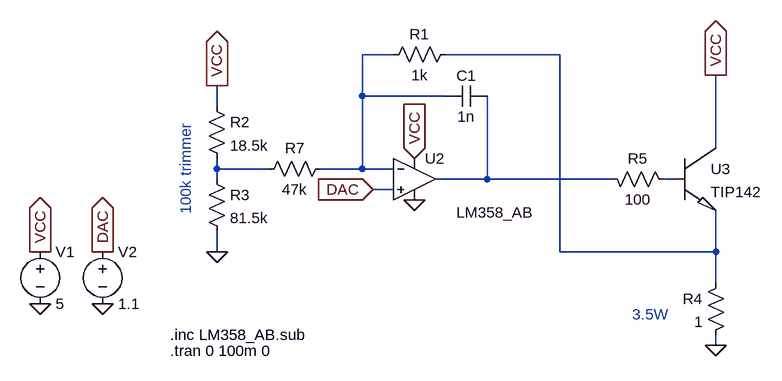
[diagram p0: schematic discharge.asc]
discharge.asc, the LTspice schematic file:
Version 4
SHEET 1 2016 680
WIRE 1168 -80 1120 -80
WIRE 1424 -80 1248 -80
WIRE 1120 -16 1120 -80
WIRE 1248 -16 1120 -16
WIRE 896 0 896 -32
WIRE 1664 64 1664 -48
WIRE 896 96 896 80
WIRE 976 96 896 96
WIRE 1120 96 1120 -16
WIRE 1120 96 1056 96
WIRE 1168 96 1120 96
WIRE 896 112 896 96
WIRE 1312 112 1312 -16
WIRE 1312 112 1232 112
WIRE 1504 112 1312 112
WIRE 1600 112 1584 112
WIRE 1168 128 1136 128
WIRE 896 224 896 192
WIRE 1424 224 1424 -80
WIRE 1664 224 1664 160
WIRE 1664 224 1424 224
WIRE 1664 272 1664 224
WIRE 1664 368 1664 352
FLAG 1136 128 DAC
IOPIN 1136 128 In
FLAG 720 304 0
FLAG 720 224 DAC
IOPIN 720 224 Out
FLAG 624 304 0
FLAG 624 224 VCC
IOPIN 624 224 Out
FLAG 1200 80 VCC
IOPIN 1200 80 In
FLAG 896 -32 VCC
IOPIN 896 -32 Out
FLAG 1664 368 0
FLAG 1664 -48 VCC
IOPIN 1664 -48 Out
FLAG 1200 144 0
FLAG 896 224 0
SYMBOL voltage 624 208 R0
WINDOW 123 0 0 Left 0
WINDOW 39 0 0 Left 0
SYMATTR InstName V1
SYMATTR Value 5
SYMBOL res 1072 80 R90
WINDOW 0 0 56 VBottom 2
WINDOW 3 32 56 VTop 2
SYMATTR InstName R7
SYMATTR Value 47k
SYMBOL OpAmps\\opamp2 1200 48 R0
WINDOW 3 65 115 Left 2
SYMATTR Value LM358_AB
SYMATTR InstName U2
SYMBOL voltage 720 208 R0
WINDOW 123 0 0 Left 0
WINDOW 39 0 0 Left 0
SYMATTR InstName V2
SYMATTR Value 1.1
SYMBOL res 1264 -96 R90
WINDOW 0 0 56 VBottom 2
WINDOW 3 32 56 VTop 2
SYMATTR InstName R1
SYMATTR Value 1k
SYMBOL res 880 -16 R0
SYMATTR InstName R2
SYMATTR Value 18.5k
SYMBOL res 880 96 R0
SYMATTR InstName R3
SYMATTR Value 81.5k
SYMBOL res 1680 256 M0
SYMATTR InstName R4
SYMATTR Value 1
SYMBOL res 1488 96 M90
WINDOW 0 0 56 VBottom 2
WINDOW 3 32 56 VTop 2
SYMATTR InstName R5
SYMATTR Value 100
SYMBOL tip142 1600 64 R0
WINDOW 0 56 32 Left 2
WINDOW 3 56 68 Left 2
SYMATTR InstName U3
SYMBOL cap 1312 -32 R90
WINDOW 0 0 32 VBottom 2
WINDOW 3 32 32 VTop 2
SYMATTR InstName C1
SYMATTR Value 1n
TEXT 824 352 Left 2 !.inc LM358_AB.sub
TEXT 824 376 Left 2 !.tran 0 100m 0
TEXT 1592 320 Right 2 ;3.5W
TEXT 848 24 VRight 2 ;100k trimmer

The netlist it stands for:
* discharge.asc
V1 VCC 0 5
R7 N001 N003 47k
XU2 DAC N001 VCC 0 N004 LM358_AB  ; pins In+ In- V+ V- OUT
V2 DAC 0 1.1
R1 N002 N001 1k
R2 VCC N003 18.5k
R3 N003 0 81.5k
R4 N002 0 1
R5 N004 N005 100
XU3 VCC N005 N002 TIP142  ; pins C B E
C1 N004 N001 1n
.inc LM358_AB.sub
.tran 0 100m 0
* 3.5W
* 100k trimmer
.lib tip142.lib
.backanno
.end